# EAGLE design schaltregler pollin (EAGLE 4.16)
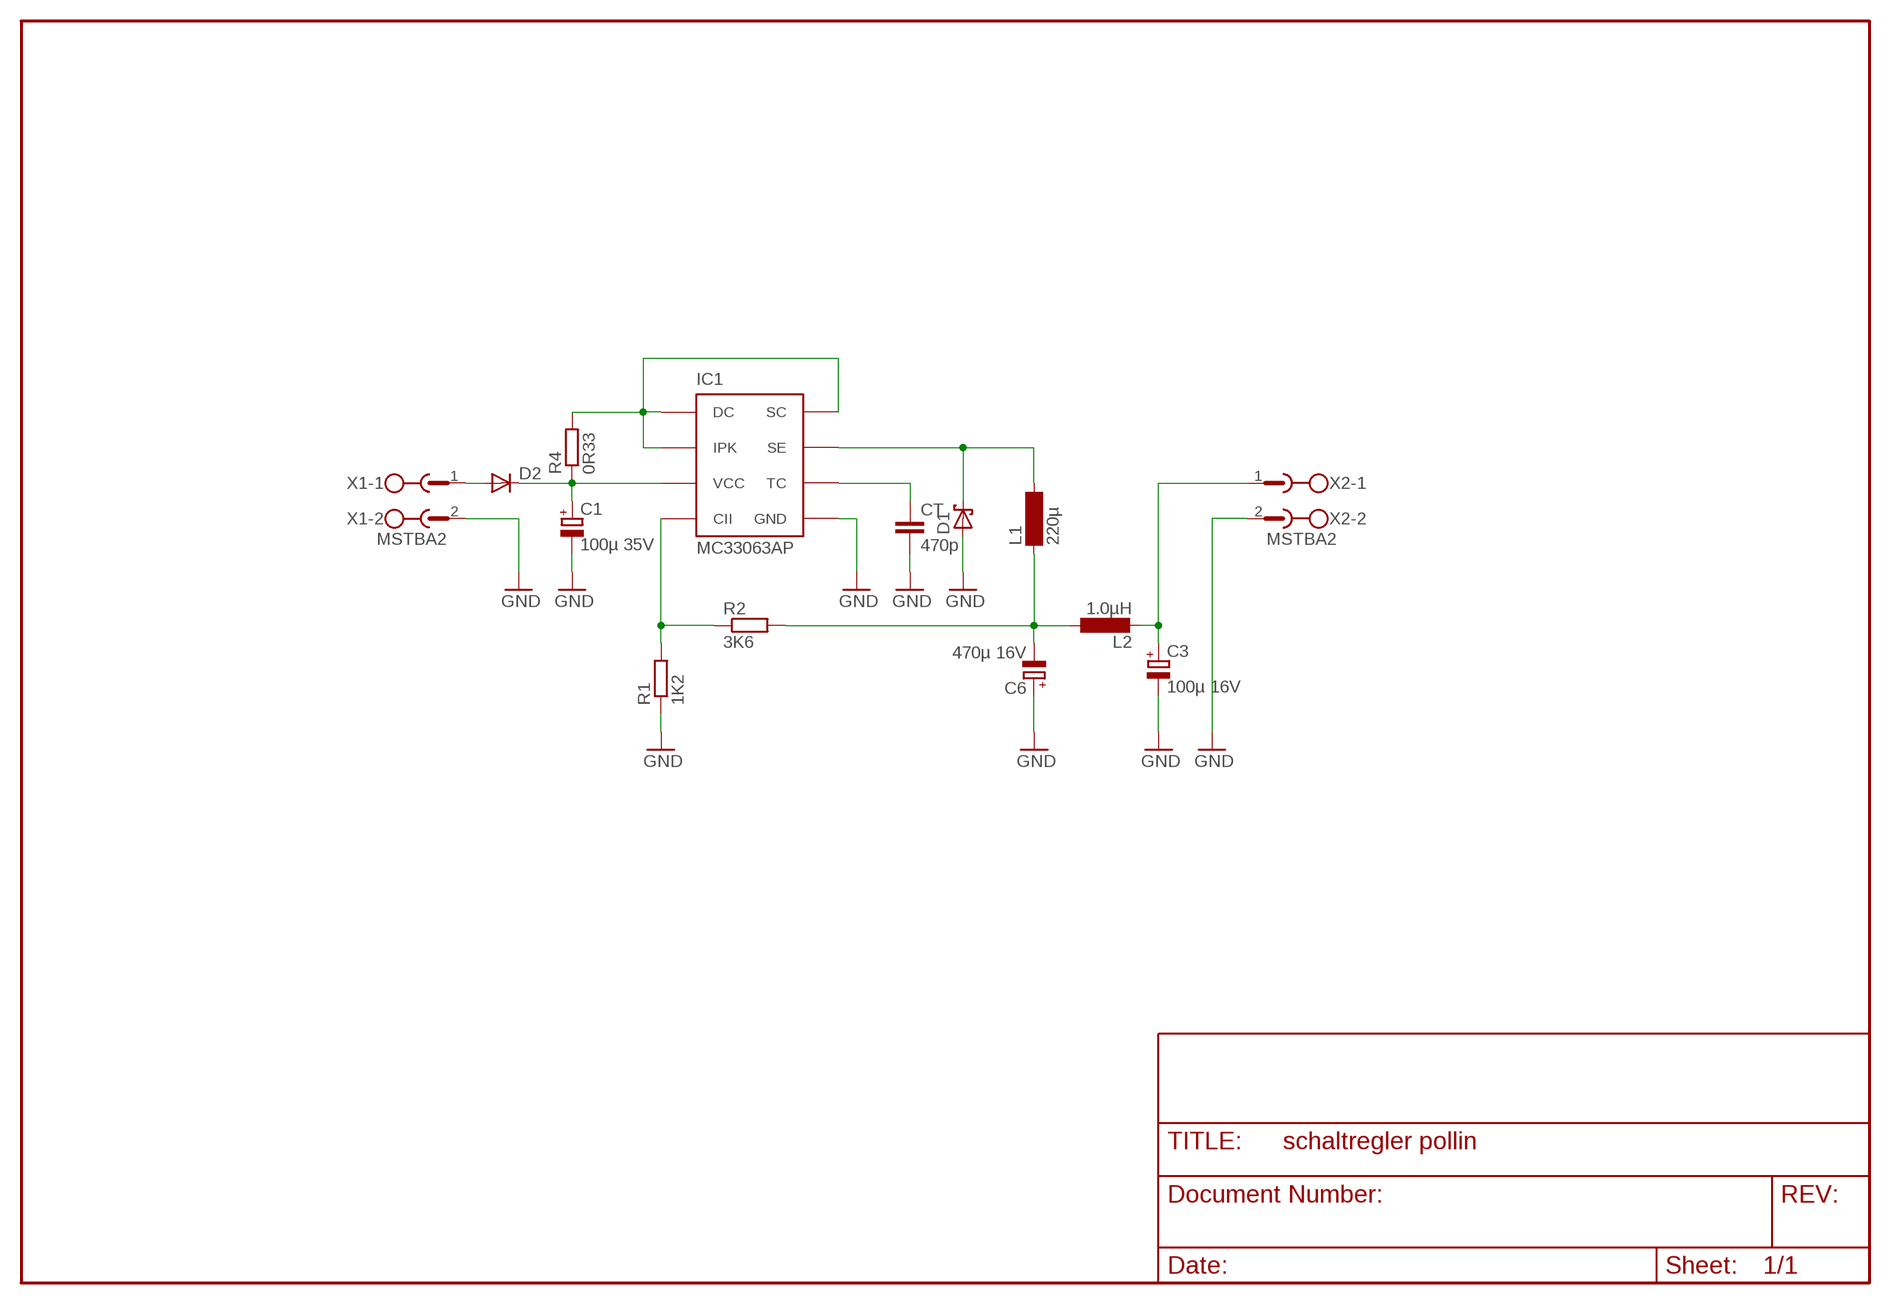
[diagram p0: schematic, sheet 1]

## Parts
C1  100µ 35V  CPOL-EUE2.5-6  [E2,5-6]
C3  100µ 16V  CPOL-EUE2.5-6  [E2,5-6]
C6  470µ 16V  CPOL-EUE2.5-6  [E2,5-6]
CT  470p  C-EU025-024X044  [C025-024X044]
D1  SCHOTTKY-DIODEDO35-7  [DO35-7]
D2  DIODE-DO34-7  [DO34-7]
IC1  MC33063AP  [DIP08]
L1  220µ  BS11  [BS11]
L2  1.0µH  L-EU2200-11.43  [2200-11.43]
R1  1K2  R-EU_0204/7  [0204/7]
R2  3K6  R-EU_0204/7  [0204/7]
R4  0R33  R-EU_0411/12  [0411/12]
X1  MSTBA2  [MSTBA2]
X2  MSTBA2  [MSTBA2]

## Nets
GND: C1.- C3.- C6.+ CT.2 D1.A IC1.4(GND) R1.1 X1.2 X2.2
N$1: IC1.1(SC) IC1.7(IPK) IC1.8(DC) R4.2
N$2: C1.+ D2.C IC1.6(VCC) R4.1
N$3: IC1.5(CII) R1.2 R2.1
N$4: D1.C IC1.2(SE) L1.2
N$5: CT.1 IC1.3(TC)
N$6: C6.- L1.1 L2.1 R2.2
N$7: C3.+ L2.2 X2.1
N$9: D2.A X1.1

## Library data of the parts
C1 C3 C6 = rcl:CPOL-EU: POLARIZED CAPACITOR, European symbol
CT = rcl:C-EU: CAPACITOR, European symbol
D1 = diode:SCHOTTKY-DIODE: Schottky Diode
D2 = diode:DIODE-: DIODE
IC1 = motorola-sensor-driver:MC33063*: DC-to-DC Converter The MC34063A Series is a monolithic control circuit containing the primary functions required for DC?to?DC converters. These devices consist of an internal temperature compensated reference, comparator, controlled duty cycle oscillator with an active current limit circuit, driver and high current output switch. This series was specifically designed to be incorporated in Step?Down and Step?Up and Voltage?Inverting applications with a minimum number of external components. Refer to Application Notes AN920A/D and AN954/D for additional design information. Operation from 3.0 V to 40 V Input Low Standby Current Current Limiting Output Switch Current to 1.5 A Output Voltage Adjustable Frequency Operation to 100 kHz Precision 2% Reference
L1 = inductor-neosid:BS: INDUCTOR nominal inductance, magnetically screened
L2 = rcl:L-EU: INDUCTOR, European symbol
R1 R2 R4 = rcl:R-EU_: RESISTOR, European symbol
X1 X2 = con-phoenix-508:MSTBA2: PHOENIX

## Board
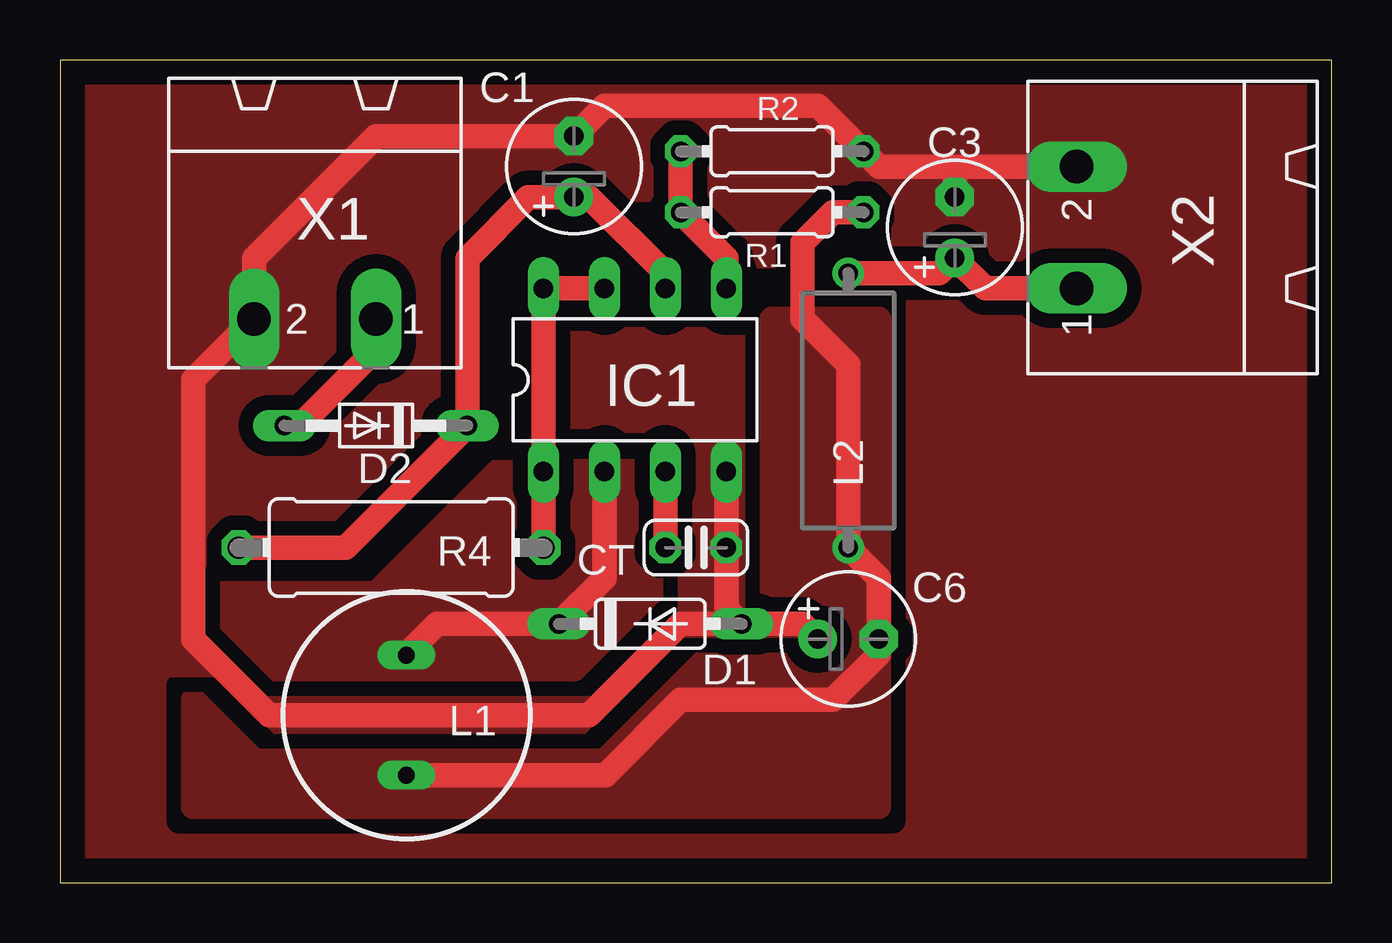
[diagram p1: board, top side]

Size 53.01 x 34.28 mm. Coordinates in mm from the lower left corner, seen from the top.
Outline: 0,0 53.01,0 53.01,34.28 0,34.28 0,0
Copper layers (1*16): Top 0.035mm / dielectric 1.5mm / Bottom 0.035mm
Design rules "default": minimum track width 10mil, minimum drill 24mil, track to track 8mil, track to pad 8mil, pad to pad 8mil, via to via 8mil, smd to smd 8mil, copper to edge 40mil, drill to drill 8mil, minimum pad ring 10mil, minimum via ring 8mil, stop-mask expansion 4mil, vias tented up to drill 0mil, thermal gap 10mil

### Footprints (pad centres in the part's own frame; a part is rotated, then mirrored left to right if it is on the bottom)
E2,5-6 = drill 0.813 pad 1.6 round: + -1.27,0 | drill 0.813 pad 1.6 octagon: - 1.27,0
C025-024X044 = drill 0.813 octagon: 1 -1.27,0; 2 1.27,0
DO35-7 = drill 0.813 long: A 3.81,0; C -3.81,0
DO34-7 = drill 0.813 long: A 3.81,0; C -3.81,0
DIP08 = drill 0.813 long: 1 -3.81,-3.81; 2 -1.27,-3.81; 3 1.27,-3.81; 4 3.81,-3.81; 5 3.81,3.81; 6 1.27,3.81; 7 -1.27,3.81; 8 -3.81,3.81
BS11 = drill 0.7 long: 1 -2.5,0; 2 2.5,0
2200-11.43 = drill 0.8 pad 1.27 round: 1 -5.715,0; 2 5.715,0
0204/7 = drill 0.813 octagon: 1 -3.81,0; 2 3.81,0
0411/12 = drill 0.914 octagon: 1 -6.35,0; 2 6.35,0
MSTBA2 = drill 1.397 long: 1 -2.54,5.08; 2 2.54,5.08

### Placement (x,y rotation side)
C1  21.42,29.84 90 top
C3  37.3,27.3 90 top
C6  32.85,10.16 0 top
CT  26.5,13.97 0 top
D1  24.6,10.79 0 top
D2  13.17,19.04 180 top
IC1  23.96,20.95 0 top
L1  14.44,6.98 90 top
L2  32.85,19.68 90 top
R1  29.68,30.47 180 top
R2  29.68,27.93 0 top
R4  13.81,13.97 0 top
X1  10.63,28.57 180 top
X2  47.46,27.3 90 top

### Tracks (layer width: path | path; a pad name or v marks a point on that pad's centre or on a via)
GND
  Top 1.016: 37.3,29.84 34.12,29.84 R1.1 31.58,32.38 22.7,32.38 C1.- 13.17,31.11 8.09,26.03 X1.2 5.55,20.95 5.55,10.16 8.73,6.98 22.06,6.98 25.87,10.79 D1.A | 37.3,29.84 X2.2 | 37.3,29.84 C3.- | IC1.4 CT.2 27.77,11.43 D1.A | C6.+ 30.95,10.79 D1.A
  pour Top (isolate 0.61, rank 3, no thermals): 0.47,34.92 53.81,34.92 53.81,-0.64 -0.8,-0.64 -0.8,34.92
N$1
  Top 1.016: IC1.7 IC1.8 IC1.1 R4.2
N$2
  Top 1.016: R4.1 11.9,13.97 D2.C 16.98,26.03 19.52,28.57 C1.+ 22.06,28.57 25.23,25.39 IC1.6
N$3
  Top 1.016: R1.2 R2.1 27.77,26.03 IC1.5
N$4
  Top 1.016: IC1.2 22.7,12.7 D1.C 15.71,10.79 14.44,9.52 L1.2
  pour Top (isolate 0.61, no thermals): 25.87,17.14 18.25,17.14 13.17,12.06 6.82,12.06 6.82,10.79 8.73,8.89 21.42,8.89 25.87,13.33
N$5
  Top 1.016: CT.1 IC1.3
N$6
  Top 1.016: R2.2 32.22,27.93 30.95,26.66 30.95,23.49 32.85,21.58 L2.1 34.12,12.7 C6.- 34.12,9.52 32.22,7.62 25.87,7.62 22.73,4.48 L1.1
  pour Top (isolate 0.61, rank 2, no thermals): 5.55,7.62 8.09,5.08 22.7,5.08 29.68,12.06 29.68,23.49 34.12,23.49 34.12,3.17 5.55,3.17
N$7
  Top 1.016: L2.2 36.66,25.39 C3.+ 38.57,24.76 X2.1
N$9
  Top 1.016: D2.A 10,19.04 13.17,22.22 X1.1